# Altium schematic sheet wifi_sensor.SchDoc
size A4
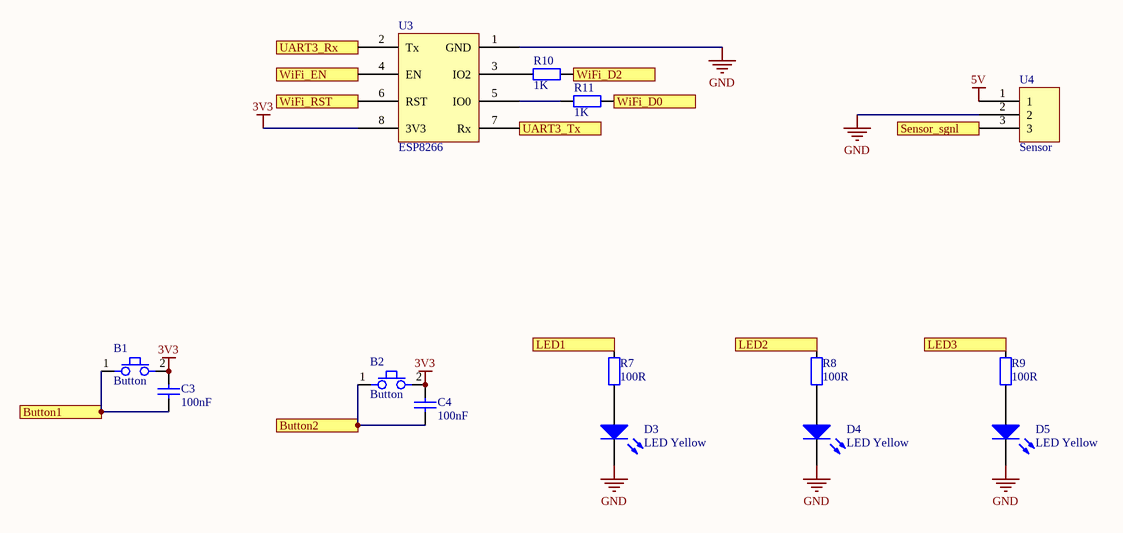
[diagram p0: wifi_sensor.SchDoc]

## Parts
B1  Button  [Button]
B2  Button  [Button]
C3  100nF  [FP_0805_CAP_085]
C4  100nF  [FP_0805_CAP_085]
D3  LED Yellow  [FP_0805_LED_RED]
D4  LED Yellow  [FP_0805_LED_RED]
D5  LED Yellow  [FP_0805_LED_RED]
R7  100R  [FP_0805_RES]
R8  100R  [FP_0805_RES]
R9  100R  [FP_0805_RES]
R10  1K  [FP_0805_RES]
R11  1K  [FP_0805_RES]
U3  ESP8266  [HDR2X4]
U4  Sensor  [3P_CONN_2mm]

## Ports
Button1, Button2, LED1, LED2, LED3, Sensor_sgnl, UART3_Rx, UART3_Tx, WiFi_D0, WiFi_D2, WiFi_EN, WiFi_RST

## Nets
3V3: B1.2 B2.2 C3.2 C4.2 U3.8(3V3)
5V: U4.1
GND: D3.2(K) D4.2(K) D5.2(K) U3.1(GND) U4.2
Button1: B1.1 C3.1 ; port Button1
Button2: B2.1 C4.1 ; port Button2
LED1: R7.2 ; port LED1
LED2: R8.2 ; port LED2
LED3: R9.2 ; port LED3
Sensor_sgnl: U4.3 ; port Sensor_sgnl
UART3_Rx: U3.2(Tx) ; port UART3_Rx
UART3_Tx: U3.7(Rx) ; port UART3_Tx
WiFi_D0: R11.2 ; port WiFi_D0
WiFi_D2: R10.2 ; port WiFi_D2
WiFi_EN: U3.4(EN) ; port WiFi_EN
WiFi_RST: U3.6(RST) ; port WiFi_RST
NetD3_1: D3.1(A) R7.1
NetD4_1: D4.1(A) R8.1
NetD5_1: D5.1(A) R9.1
NetR10_1: R10.1 U3.3(IO2)
NetR11_1: R11.1 U3.5(IO0)

## Library data of the parts
B1 B2 = Button: Name: TACT 2.5x 3 2P SPST B3U-1000P (OMR) 2.5x3x1.2mm SMD H=1.2mm 153g; Reference: 45-09-96; Supplier: Lomex
C3 C4 = CAP 100nF: Capacitor; Tolerance: 10%; Voltage: 50V; Name: 100nF 0805 10% 50V X7R 0805B104K500CT (WAL); Supplier: Lomex; Reference: 82-10-76; Value: 100nF
D3-D5 = LED Yellow: Yellow LED; pin to pad: 1>A 2>K; U_fw: 2.1V; I_max: 20mA; Name: 2012 YELLOW 590nm 220mcd 0805UYC (FEM) 20mA W.CLEAR 2.0x1.2x0.68mm 0805 140°; Wavelength: 590nm; Supplier: Lomex; Reference: 95-03-84
R7-R9 = RES 100R: Resistor; Tolerance: 5%; Power: 125mW; Name: YAGEO (PHYCOMP)  RC0805JR-07100RL  SMD Chip Resistor, Thick Film, 100 ohm,; Reference: 9233881; Supplier: Farnell; Value: 100R
R10 R11 = RES 1K: Resistor; Tolerance: 5%; Power: 125mW; Name: YAGEO (PHYCOMP)  RC0805JR-071KL  SMD Chip Resistor, Thick Film, 1 kohm; Reference: 9234004; Supplier: Farnell; Value: 1K
U4 = Conn_3P: Name: TÁPCSATL. 2.00mm 3P APA 180° NCW200-03S (G-S) FORR.; Supplier: Lomex; Reference: 43-16-04